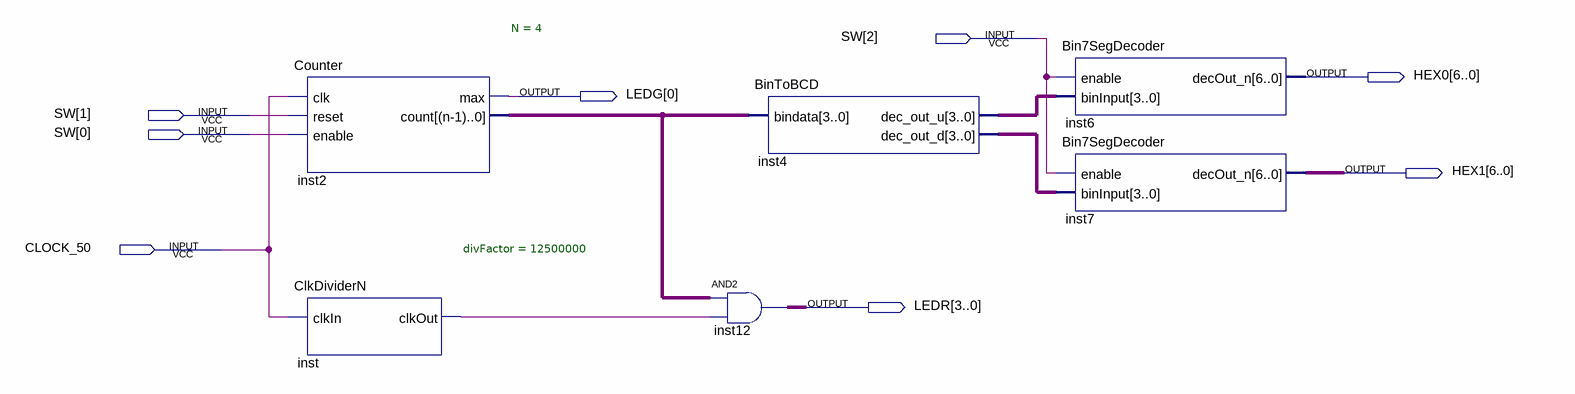
[diagram p0: schematic sheet]
// Quartus schematic mini_projeto_schem.bdf as structural Verilog: 6 symbols, 8 pins
module mini_projeto_schem (
  input  [2:0] SW,
  input  CLOCK_50,
  output [6:0] HEX0,
  output [0:0] LEDG,
  output [6:0] HEX1,
  output [3:0] LEDR
);

  wire inst_clkout;
  wire [3:0] inst2_count, inst4_dec_out_d, inst4_dec_out_u;

  Counter #(.N(4)) inst2 (.clk(CLOCK_50), .reset(SW[1]), .enable(SW[0]), .max(LEDG[0]), .count(inst2_count));
  ClkDividerN #(.divFactor(12500000)) inst (.clkIn(CLOCK_50), .clkOut(inst_clkout));
  assign LEDR = inst2_count & {4{inst_clkout}};  // AND2 inst12, 4 bits wide
  BinToBCD inst4 (.bindata(inst2_count), .dec_out_u(inst4_dec_out_u), .dec_out_d(inst4_dec_out_d));
  Bin7SegDecoder inst6 (.enable(SW[2]), .binInput(inst4_dec_out_u), .decOut_n(HEX0));
  Bin7SegDecoder inst7 (.enable(SW[2]), .binInput(inst4_dec_out_d), .decOut_n(HEX1));
endmodule
